# Altium project rp-fly.PrjPcb
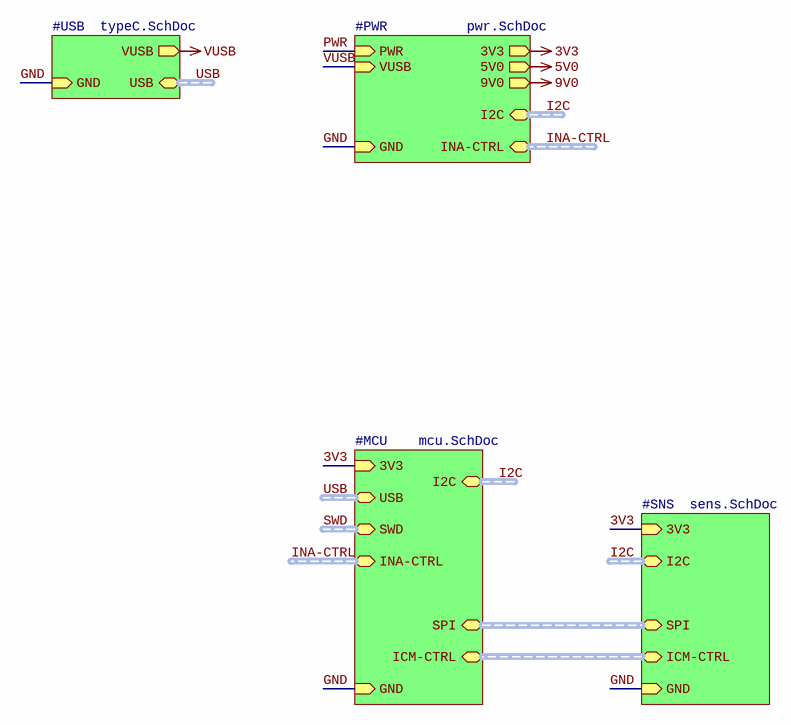
[diagram p0: rp-fly.SchDoc]
9 sheets, 46 parts. Net scope: hierarchical (ports join the sheet entries above them; power ports are global).
Board file: rp-fly.PcbDoc
Sheets:
  rp-fly.SchDoc
    #MCU = mcu.SchDoc
    #USB = typeC.SchDoc
    #PWR = pwr.SchDoc
      #9V0 = 9V0.SchDoc
      #5V0 = 5V0.SchDoc
      #LDO = LDO.SchDoc
      #INA = INA.SchDoc
    #SNS = sens.SchDoc

## Sheet rp-fly.SchDoc
size 209 x 297 mm; DocumentCode: Децимальный номер; SchemeType: Схема электрическая принципиальная; TitleLine1: Название проекта (строка 1); TitleLine2: Название проекта (строка 2); PageSetup: Record=PageOptionsZCenterHorizontal=TrueZCenterVertical=TrueZPrintScale=0.95ZXCorrection=1.00ZYCorrection=1.00ZPrintKind=2ZBorderSize=5000000ZLeftOffset=0ZBottomOffset=0ZOrientation=1ZPaperLength=1000ZPaperWidth=1000ZScale=100ZPaperSource=7ZPrintQuality=600ZMediaType=1ZDitherType=10ZPaperKind=A4 (210 x 297 мм)ZPrintScaleMode=1

### Sub-sheets
#MCU = mcu.SchDoc: 3V3 (in), GND (in), USB (harness USB), SWD (harness SWD), I2C (harness I2C), INA-CTRL (harness INA-CTRL), SPI (harness SPI), ICM-CTRL (harness ICM-CTRL)
#PWR = pwr.SchDoc: PWR (in), VUSB (in), GND (in), 3V3 (out), 5V0 (out), I2C (harness I2C), INA-CTRL (harness INA-CTRL), 9V0 (out)
#SNS = sens.SchDoc: GND (in), 3V3 (in), I2C (harness I2C), SPI (harness SPI), ICM-CTRL (harness ICM-CTRL)
#USB = typeC.SchDoc: USB (harness USB), GND (in), VUSB (out)

### Nets
3V3: sheet #MCU/3V3, sheet #PWR/3V3, sheet #SNS/3V3
GND: sheet #MCU/GND, sheet #USB/GND, sheet #PWR/GND, sheet #SNS/GND
VUSB: sheet #USB/VUSB, sheet #PWR/VUSB

### Buses and harness runs
harness I2C = sheet #MCU/I2C
harness I2C = sheet #PWR/I2C
harness I2C = sheet #SNS/I2C
harness INA-CTRL = sheet #MCU/INA-CTRL
harness INA-CTRL = sheet #PWR/INA-CTRL
harness sheet #MCU/ICM-CTRL = sheet #SNS/ICM-CTRL
harness sheet #MCU/SPI = sheet #SNS/SPI
harness SWD = sheet #MCU/SWD
harness USB = sheet #MCU/USB
harness USB = sheet #USB/USB

### Notes on the sheet
- Перв. примен.
- Справ. №
- Подп. и дата
- Инв. № дубл.
- Взам. инв. №
- Разраб.
- Изм.
- Лист
- № докум.
- Подп.
- Дата
- Лит.
- Масса
- Масштаб
- Пров.
- Т. контр.
- Листов
- Н. контр.
- Утв.
- Нач. лаб.
- Инв. № подл.
- Копировал
- Формат А4

## Sheet mcu.SchDoc
size 209 x 297 mm; DocumentCode: Децимальный номер; SchemeType: Схема электрическая принципиальная; PageSetup: Record=PageOptionsZCenterHorizontal=TrueZCenterVertical=TrueZPrintScale=0.95ZXCorrection=1.00ZYCorrection=1.00ZPrintKind=2ZBorderSize=5000000ZLeftOffset=0ZBottomOffset=0ZOrientation=1ZPaperLength=1000ZPaperWidth=1000ZScale=100ZPaperSource=7ZPrintQuality=600ZMediaType=1ZDitherType=10ZPaperKind=A4 (210 x 297 мм)ZPrintScaleMode=1
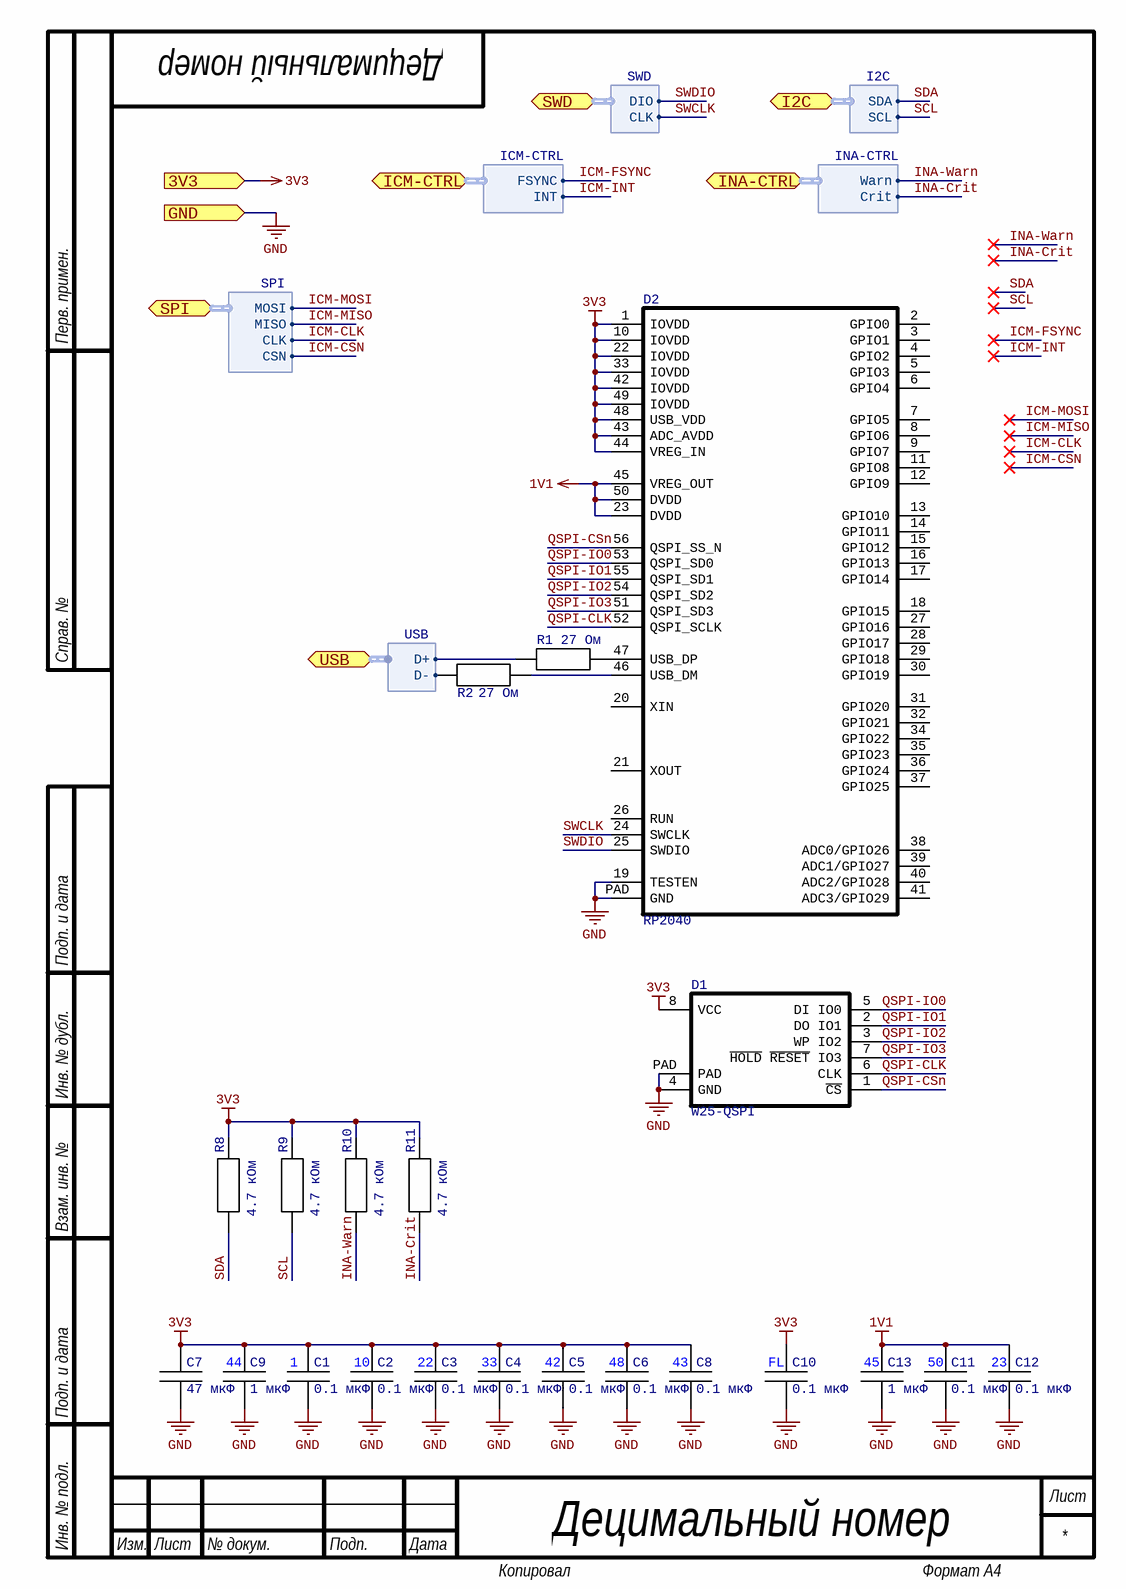
[diagram p1: mcu.SchDoc]

### Parts
C1  value 0.1 мкФ  [STD-0402]  (hidden comment: cap)
C2  value 0.1 мкФ  [STD-0402]  (hidden comment: cap)
C3  value 0.1 мкФ  [STD-0402]  (hidden comment: cap)
C4  value 0.1 мкФ  [STD-0402]  (hidden comment: cap)
C5  value 0.1 мкФ  [STD-0402]  (hidden comment: cap)
C6  value 0.1 мкФ  [STD-0402]  (hidden comment: cap)
C7  value 47 мкФ  [STD-0805]  (hidden comment: cap)
C8  value 0.1 мкФ  [STD-0402]  (hidden comment: cap)
C9  value 1 мкФ  [STD-0402]  (hidden comment: cap)
C10  value 0.1 мкФ  [STD-0402]  (hidden comment: cap)
C11  value 0.1 мкФ  [STD-0402]  (hidden comment: cap)
C12  value 0.1 мкФ  [STD-0402]  (hidden comment: cap)
C13  value 1 мкФ  [STD-0402]  (hidden comment: cap)
D1  W25-QSPI  [WSON-8]
D2  RP2040  [QFN-56]
R1  value 27 Ом  [STD-0402]  (hidden comment: res)
R2  value 27 Ом  [STD-0402]  (hidden comment: res)
R8  value 4.7 кОм  [STD-0402]  (hidden comment: res)
R9  value 4.7 кОм  [STD-0402]  (hidden comment: res)
R10  value 4.7 кОм  [STD-0402]  (hidden comment: res)
R11  value 4.7 кОм  [STD-0402]  (hidden comment: res)

### Ports
3V3 (in), GND (in), I2C (harness I2C), ICM-CTRL (harness ICM-CTRL), INA-CTRL (harness INA-CTRL), SPI (harness SPI), SWD (harness SWD), USB (harness USB)

### Harnesses
USB: D+, D-
I2C: SDA, SCL
INA-CTRL: Warn, Crit
SWD: DIO, CLK
ICM-CTRL: FSYNC, INT
SPI: MOSI, MISO, CLK, CSN

### Nets
1V1: C11.2 C12.2 C13.2 D2.23(DVDD) D2.45(VREG_OUT) D2.50(DVDD)
3V3: C1.2 C2.2 C3.2 C4.2 C5.2 C6.2 C7.2 C8.2 C9.2 C10.2 D1.8(VCC) D2.1(IOVDD) D2.10(IOVDD) D2.22(IOVDD) D2.33(IOVDD) D2.42(IOVDD) D2.43(ADC_AVDD) D2.44(VREG_IN) D2.48(USB_VDD) D2.49(IOVDD) R8.2 R9.2 R10.2 R11.2 ; port 3V3
GND: C1.1 C2.1 C3.1 C4.1 C5.1 C6.1 C7.1 C8.1 C9.1 C10.1 C11.1 C12.1 C13.1 D1.4(GND) D1.PAD D2.19(TESTEN) D2.PAD(GND) ; port GND
INA-Crit: R11.1 ; port INA-CTRL.Crit
INA-Warn: R10.1 ; port INA-CTRL.Warn  [project net INA-CTRL.Warn]
QSPI-CLK: D1.6(CLK) D2.52(QSPI_SCLK)
QSPI-CSn: D1.1(~{CS}) D2.56(QSPI_SS_N)
QSPI-IO0: D1.5(DI_IO0) D2.53(QSPI_SD0)
QSPI-IO1: D1.2(DO_IO1) D2.55(QSPI_SD1)
QSPI-IO2: D1.3(WP_IO2) D2.54(QSPI_SD2)
QSPI-IO3: D1.7(~{HOLD}_~{RESET}_IO3) D2.51(QSPI_SD3)
SCL: R9.1 ; port I2C.SCL  [project net I2C.SCL]
SDA: R8.1 ; port I2C.SDA  [project net I2C.SDA]
SWCLK: D2.24(SWCLK) ; port SWD.CLK
SWDIO: D2.25(SWDIO) ; port SWD.DIO  [project net SWD.DIO]
USB.D+: R1.1 ; port USB.D+
USB.D-: R2.1 ; port USB.D-
NetD2_46: D2.46(USB_DM) R2.2
NetD2_47: D2.47(USB_DP) R1.2

Not connected (* = marked no-connect by the designer): D2 2(GPIO0) 3(GPIO1) 4(GPIO2) 5(GPIO3) 6(GPIO4) 7(GPIO5) 8(GPIO6) 9(GPIO7) 11(GPIO8) 12(GPIO9) 13(GPIO10) 14(GPIO11) 15(GPIO12) 16(GPIO13) 17(GPIO14) 18(GPIO15) 20(XIN) 21(XOUT) 26(RUN) 27(GPIO16) 28(GPIO17) 29(GPIO18) 30(GPIO19) 31(GPIO20) 32(GPIO21) 34(GPIO22) 35(GPIO23) 36(GPIO24) 37(GPIO25) 38(ADC0/GPIO26) 39(ADC1/GPIO27) 40(ADC2/GPIO28) 41(ADC3/GPIO29)

### Notes on the sheet
- (near C9) 44
- (near C1) 1
- (near C2) 10
- (near C3) 22
- (near C4) 33
- (near C5) 42
- (near C6) 48
- (near C8) 43
- (near C10) FL
- (near C13) 45
- (near C11) 50
- (near C12) 23
- Перв. примен.
- Справ. №
- Подп. и дата
- Инв. № дубл.
- Взам. инв. №
- Изм.
- Лист
- № докум.
- Подп.
- Дата
- Инв. № подл.
- Копировал
- Формат А4

### Library data of the parts
C1-C6 C8 C10-C12 = C0402-0u1-50v-10%-X7R: Конденсатор; Part Number: C0402-0u1-50v-10%-X7R
C7 = C0805-47u-6.3v-20%-X5R: Конденсатор; Part Number: C0805-47u-6.3v-20%-X5R
C9 C13 = C0402-1u-16v-10%-X7R: Конденсатор; Part Number: C0402-1u-16v-10%-X7R
D1 = W25Q128JVPIQ: Flash память 16 МБайт; Part Number: W25Q128JVPIQ
D2 = RP2040: Микроконтроллер; Part Number: RP2040
R1 R2 = R0402-27r-1%-1/16W: Резистор; Part Number: R0402-27r-1%-1/16W
R8-R11 = R0402-4k7-1%-1/16W: Резистор; Part Number: R0402-4k7-1%-1/16W

## Sheet typeC.SchDoc
size 209 x 297 mm; DocumentCode: Децимальный номер; SchemeType: Схема электрическая принципиальная; PageSetup: Record=PageOptionsZCenterHorizontal=TrueZCenterVertical=TrueZPrintScale=0.95ZXCorrection=1.00ZYCorrection=1.00ZPrintKind=2ZBorderSize=5000000ZLeftOffset=0ZBottomOffset=0ZOrientation=1ZPaperLength=1000ZPaperWidth=1000ZScale=100ZPaperSource=7ZPrintQuality=600ZMediaType=1ZDitherType=10ZPaperKind=A4 (210 x 297 мм)ZPrintScaleMode=1
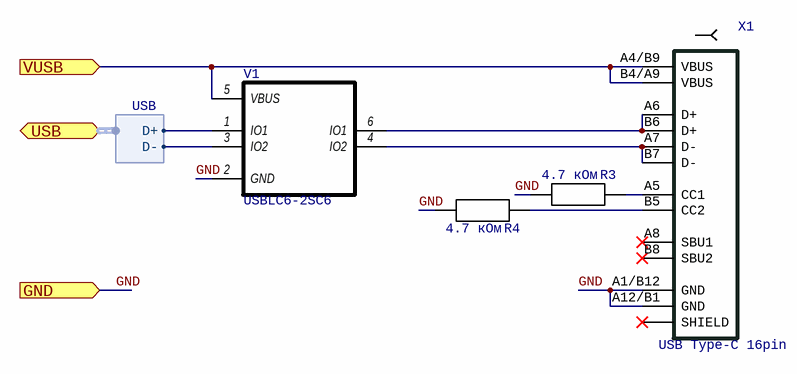
[diagram p2: typeC.SchDoc]

### Parts
R3  value 4.7 кОм  [STD-0402]  (hidden comment: res)
R4  value 4.7 кОм  [STD-0402]  (hidden comment: res)
V1  USBLC6-2SC6  [SOT-23-6]
X1  USB Type-C 16pin  [USB Type-C]

### Ports
GND (in), USB (harness USB), VUSB (in)

### Harnesses
USB: D+, D-

### Nets
GND: R3.2 R4.2 V1.2(GND) X1.A1/B12(GND) X1.A12/B1(GND) ; port GND
VUSB: V1.5(VBUS) X1.A4/B9(VBUS) X1.B4/A9(VBUS) ; port VUSB
USB.D+: V1.1(IO1) ; port USB.D+
USB.D-: V1.3(IO2) ; port USB.D-
NetR3_1: R3.1 X1.A5(CC1)
NetR4_1: R4.1 X1.B5(CC2)
NetV1_4: V1.4(IO2) X1.A7(D-) X1.B7(D-)
NetV1_6: V1.6(IO1) X1.A6(D+) X1.B6(D+)

Not connected (* = marked no-connect by the designer): X1 A8(SBU1)* B8(SBU2)* SHIELD*

### Notes on the sheet
- Перв. примен.
- Справ. №
- Подп. и дата
- Инв. № дубл.
- Взам. инв. №
- Изм.
- Лист
- № докум.
- Подп.
- Дата
- Инв. № подл.
- Копировал
- Формат А4

### Library data of the parts
R3 R4 = R0402-4k7-1%-1/16W: Резистор; Part Number: R0402-4k7-1%-1/16W
V1 = CMP-0703-A.2: ESD защита, 3.5 пФ, 150 нА, USB; Manufacturer: ST Microelectronics; Temperature: -40 - 150°C
X1 = USB Type-C 16 pin ALI: USB Type-C; Part Number: USB Type-C 16 pin ALI

## Sheet pwr.SchDoc
size 209 x 297 mm; DocumentCode: Децимальный номер; SchemeType: Схема электрическая принципиальная; PageSetup: Record=PageOptionsZCenterHorizontal=TrueZCenterVertical=TrueZPrintScale=0.95ZXCorrection=1.00ZYCorrection=1.00ZPrintKind=2ZBorderSize=5000000ZLeftOffset=0ZBottomOffset=0ZOrientation=1ZPaperLength=1000ZPaperWidth=1000ZScale=100ZPaperSource=7ZPrintQuality=600ZMediaType=1ZDitherType=10ZPaperKind=A4 (210 x 297 мм)ZPrintScaleMode=1
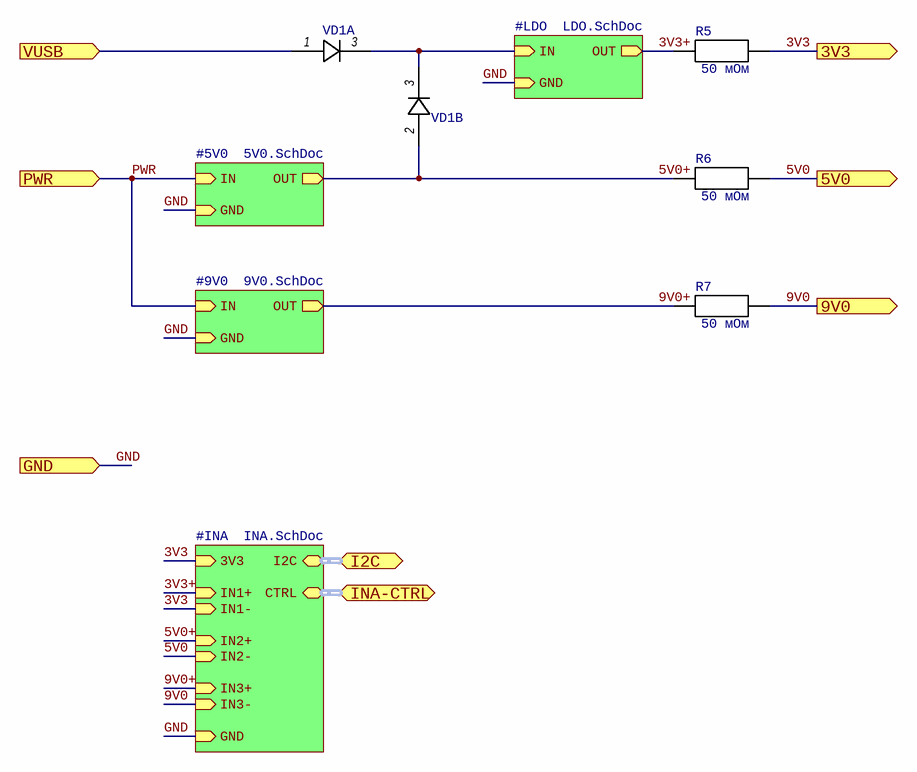
[diagram p3: pwr.SchDoc]

### Parts
R5  value 50 мОм  [STD-0805]  (hidden comment: res)
R6  value 50 мОм  [STD-0805]  (hidden comment: res)
R7  value 50 мОм  [STD-0805]  (hidden comment: res)
VD1  diode-2k  [SOT-23-3]  (value not drawn)  (parts A,B of 2)

### Sub-sheets
#5V0 = 5V0.SchDoc: GND (in), IN (in), OUT (out)
#9V0 = 9V0.SchDoc: GND (in), IN (in), OUT (out)
#INA = INA.SchDoc: GND (in), 3V3 (in), IN1+ (in), IN1- (in), IN2+ (in), IN2- (in), IN3+ (in), IN3- (in), I2C (harness I2C), CTRL (harness INA-CTRL)
#LDO = LDO.SchDoc: GND (in), IN (in), OUT (out)

### Ports
3V3 (out), 5V0 (out), 9V0 (out), GND (in), I2C (harness I2C), INA-CTRL (harness I2C), PWR (in), VUSB (in)

### Nets
3V3: R5.2 ; port 3V3, sheet #INA/3V3, sheet #INA/IN1-
5V0: R6.2 ; port 5V0, sheet #INA/IN2-
9V0: R7.2 ; port 9V0, sheet #INA/IN3-
GND: port GND, sheet #9V0/GND, sheet #5V0/GND, sheet #LDO/GND, sheet #INA/GND
VUSB: VD1.1 ; port VUSB
3V3+: R5.1 ; sheet #LDO/OUT, sheet #INA/IN1+
5V0+: R6.1 VD1.2 ; sheet #5V0/OUT, sheet #INA/IN2+
9V0+: R7.1 ; sheet #9V0/OUT, sheet #INA/IN3+
PWR: port PWR, sheet #9V0/IN, sheet #5V0/IN
NetC14_2: VD1.3 ; sheet #LDO/IN

### Buses and harness runs
harness port I2C = sheet #INA/I2C
harness port INA-CTRL = sheet #INA/CTRL

### Notes on the sheet
- Перв. примен.
- Справ. №
- Подп. и дата
- Инв. № дубл.
- Взам. инв. №
- Изм.
- Лист
- № докум.
- Подп.
- Дата
- Инв. № подл.
- Копировал
- Формат А4

### Library data of the parts
R5-R7 = R0805-r05-1%-1/4W: Резистор; Part Number: R0805-r05-1%-1/4W
VD1 = PMEG2005CT.215: Диод сдвоенный; Part Number: PMEG2005CT.215

## Sheet 9V0.SchDoc
size 209 x 297 mm; DocumentCode: Децимальный номер; SchemeType: Схема электрическая принципиальная; PageSetup: Record=PageOptionsZCenterHorizontal=TrueZCenterVertical=TrueZPrintScale=0.95ZXCorrection=1.00ZYCorrection=1.00ZPrintKind=2ZBorderSize=5000000ZLeftOffset=0ZBottomOffset=0ZOrientation=1ZPaperLength=1000ZPaperWidth=1000ZScale=100ZPaperSource=7ZPrintQuality=600ZMediaType=1ZDitherType=10ZPaperKind=A4 (210 x 297 мм)ZPrintScaleMode=1

### Notes on the sheet
- Перв. примен.
- Справ. №
- Подп. и дата
- Инв. № дубл.
- Взам. инв. №
- Изм.
- Лист
- № докум.
- Подп.
- Дата
- Инв. № подл.
- Копировал
- Формат А4

## Sheet 5V0.SchDoc
size 209 x 297 mm; DocumentCode: Децимальный номер; SchemeType: Схема электрическая принципиальная; PageSetup: Record=PageOptionsZCenterHorizontal=TrueZCenterVertical=TrueZPrintScale=0.95ZXCorrection=1.00ZYCorrection=1.00ZPrintKind=2ZBorderSize=5000000ZLeftOffset=0ZBottomOffset=0ZOrientation=1ZPaperLength=1000ZPaperWidth=1000ZScale=100ZPaperSource=7ZPrintQuality=600ZMediaType=1ZDitherType=10ZPaperKind=A4 (210 x 297 мм)ZPrintScaleMode=1
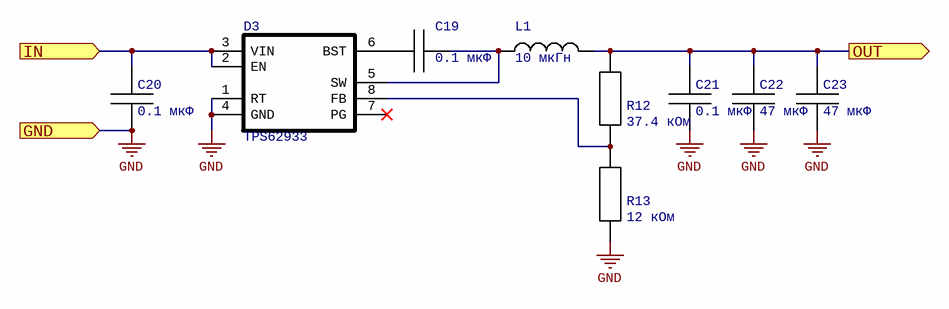
[diagram p4: 5V0.SchDoc]

### Parts
C19  value 0.1 мкФ  [STD-0402]  (hidden comment: cap)
C20  value 0.1 мкФ  [STD-0402]  (hidden comment: cap)
C21  value 0.1 мкФ  [STD-0402]  (hidden comment: cap)
C22  value 47 мкФ  [STD-0805]  (hidden comment: cap)
C23  value 47 мкФ  [STD-0805]  (hidden comment: cap)
D3  TPS62933  [SOT-583]
L1  value 10 мкГн  [IND-0630]  (hidden comment: ind)
R12  value 37.4 кОм  [STD-0402]  (hidden comment: res)
R13  value 12 кОм  [STD-0402]  (hidden comment: res)

### Ports
GND (in), IN (in), OUT (out)

### Nets
GND: C20.1 C21.1 C22.1 C23.1 D3.1(RT) D3.4(GND) R13.1 ; port GND
5V0+: C21.2 C22.2 C23.2 L1.2 R12.2 ; port OUT
PWR: C20.2 D3.2(EN) D3.3(VIN) ; port IN
NetC19_1: C19.1 D3.5(SW) L1.1
NetC19_2: C19.2 D3.6(BST)
NetD3_8: D3.8(FB) R12.1 R13.2

Not connected (* = marked no-connect by the designer): D3 7(PG)*

### Notes on the sheet
- Перв. примен.
- Справ. №
- Подп. и дата
- Инв. № дубл.
- Взам. инв. №
- Изм.
- Лист
- № докум.
- Подп.
- Дата
- Инв. № подл.
- Копировал
- Формат А4

### Library data of the parts
C19-C21 = C0402-0u1-50v-10%-X7R: Конденсатор; Part Number: C0402-0u1-50v-10%-X7R
C22 C23 = C0805-47u-6.3v-20%-X5R: Конденсатор; Part Number: C0805-47u-6.3v-20%-X5R
D3 = TPS62933PDRLR: DC-DC; Part Number: TPS62933PDRLR
L1 = CKST0603-10: Индуктивность; Part Number: CKST0603-10
R12 = R0402-37k4-1%-1/16W: Резистор; Part Number: R0402-37k4-1%-1/16W
R13 = R0402-12k-1%-1/16W: Резистор; Part Number: R0402-12k-1%-1/16W

## Sheet LDO.SchDoc
size 209 x 297 mm; DocumentCode: Децимальный номер; SchemeType: Схема электрическая принципиальная; PageSetup: Record=PageOptionsZCenterHorizontal=TrueZCenterVertical=TrueZPrintScale=0.95ZXCorrection=1.00ZYCorrection=1.00ZPrintKind=2ZBorderSize=5000000ZLeftOffset=0ZBottomOffset=0ZOrientation=1ZPaperLength=1000ZPaperWidth=1000ZScale=100ZPaperSource=7ZPrintQuality=600ZMediaType=1ZDitherType=10ZPaperKind=A4 (210 x 297 мм)ZPrintScaleMode=1
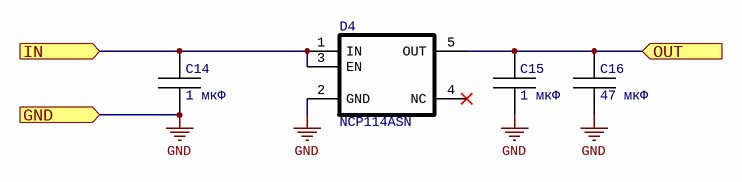
[diagram p5: LDO.SchDoc]

### Parts
C14  value 1 мкФ  [STD-0402]  (hidden comment: cap)
C15  value 1 мкФ  [STD-0402]  (hidden comment: cap)
C16  value 47 мкФ  [STD-0805]  (hidden comment: cap)
D4  NCP114ASN  [SOT-23-5]

### Ports
GND (in), IN (in), OUT (in)

### Nets
GND: C14.1 C15.1 C16.1 D4.2(GND) ; port GND
3V3+: C15.2 C16.2 D4.5(OUT) ; port OUT
NetC14_2: C14.2 D4.1(IN) D4.3(EN) ; port IN

Not connected (* = marked no-connect by the designer): D4 4(NC)*

### Notes on the sheet
- Перв. примен.
- Справ. №
- Подп. и дата
- Инв. № дубл.
- Взам. инв. №
- Изм.
- Лист
- № докум.
- Подп.
- Дата
- Инв. № подл.
- Копировал
- Формат А4

### Library data of the parts
C14 C15 = C0402-1u-16v-10%-X7R: Конденсатор; Part Number: C0402-1u-16v-10%-X7R
C16 = C0805-47u-6.3v-20%-X5R: Конденсатор; Part Number: C0805-47u-6.3v-20%-X5R
D4 = NCP114ASN330T1G: LDO; Part Number: NCP114ASN330T1G

## Sheet INA.SchDoc
size 209 x 297 mm; DocumentCode: Децимальный номер; SchemeType: Схема электрическая принципиальная; PageSetup: Record=PageOptionsZCenterHorizontal=TrueZCenterVertical=TrueZPrintScale=0.95ZXCorrection=1.00ZYCorrection=1.00ZPrintKind=2ZBorderSize=5000000ZLeftOffset=0ZBottomOffset=0ZOrientation=1ZPaperLength=1000ZPaperWidth=1000ZScale=100ZPaperSource=7ZPrintQuality=600ZMediaType=1ZDitherType=10ZPaperKind=A4 (210 x 297 мм)ZPrintScaleMode=1
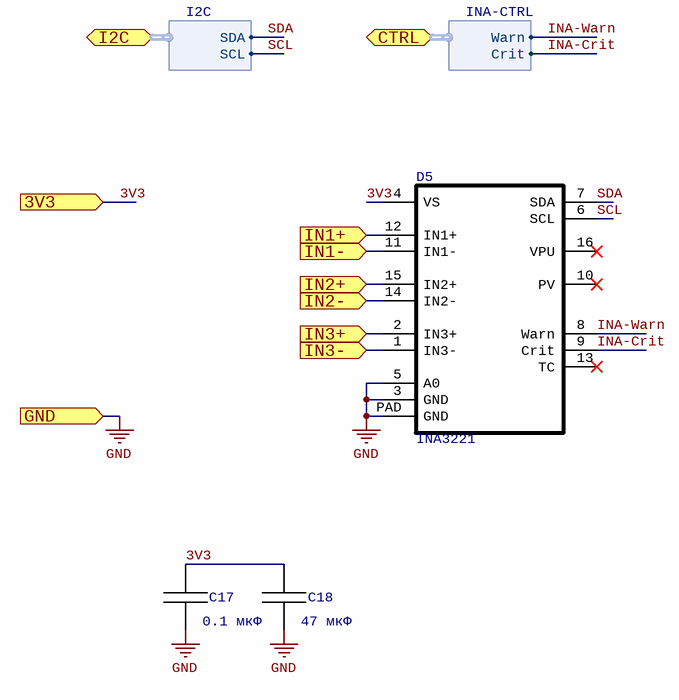
[diagram p6: INA.SchDoc]

### Parts
C17  value 0.1 мкФ  [STD-0402]  (hidden comment: cap)
C18  value 47 мкФ  [STD-0805]  (hidden comment: cap)
D5  INA3221  [VQFN-16]

### Ports
3V3 (in), CTRL (harness INA-CTRL), GND (in), I2C (harness I2C), IN1+ (in), IN1- (in), IN2+ (in), IN2- (in), IN3+ (in), IN3- (in)

### Harnesses
I2C: SDA, SCL
INA-CTRL: Warn, Crit

### Nets
3V3: C17.2 C18.2 D5.4(VS) D5.11(IN1-) ; port IN1-, port 3V3
5V0: D5.14(IN2-) ; port IN2-
9V0: D5.1(IN3-) ; port IN3-
GND: C17.1 C18.1 D5.3(GND) D5.5(A0) D5.PAD(GND) ; port GND
3V3+: D5.12(IN1+) ; port IN1+
5V0+: D5.15(IN2+) ; port IN2+
9V0+: D5.2(IN3+) ; port IN3+
INA-Crit: D5.9(Crit) ; port CTRL.Crit
INA-Warn: D5.8(Warn) ; port CTRL.Warn  [project net INA-CTRL.Warn]
SCL: D5.6(SCL) ; port I2C.SCL  [project net I2C.SCL]
SDA: D5.7(SDA) ; port I2C.SDA  [project net I2C.SDA]

Not connected (* = marked no-connect by the designer): D5 10(PV)* 13(TC)* 16(VPU)*

### Notes on the sheet
- Перв. примен.
- Справ. №
- Подп. и дата
- Инв. № дубл.
- Взам. инв. №
- Изм.
- Лист
- № докум.
- Подп.
- Дата
- Инв. № подл.
- Копировал
- Формат А4

### Library data of the parts
C17 = C0402-0u1-50v-10%-X7R: Конденсатор; Part Number: C0402-0u1-50v-10%-X7R
C18 = C0805-47u-6.3v-20%-X5R: Конденсатор; Part Number: C0805-47u-6.3v-20%-X5R
D5 = INA3221AIRGVT: Монитор питания; Part Number: INA3221AIRGVT

## Sheet sens.SchDoc
size 209 x 297 mm; DocumentCode: Децимальный номер; SchemeType: Схема электрическая принципиальная; PageSetup: Record=PageOptionsZCenterHorizontal=TrueZCenterVertical=TrueZPrintScale=0.95ZXCorrection=1.00ZYCorrection=1.00ZPrintKind=2ZBorderSize=5000000ZLeftOffset=0ZBottomOffset=0ZOrientation=1ZPaperLength=1000ZPaperWidth=1000ZScale=100ZPaperSource=7ZPrintQuality=600ZMediaType=1ZDitherType=10ZPaperKind=A4 (210 x 297 мм)ZPrintScaleMode=1
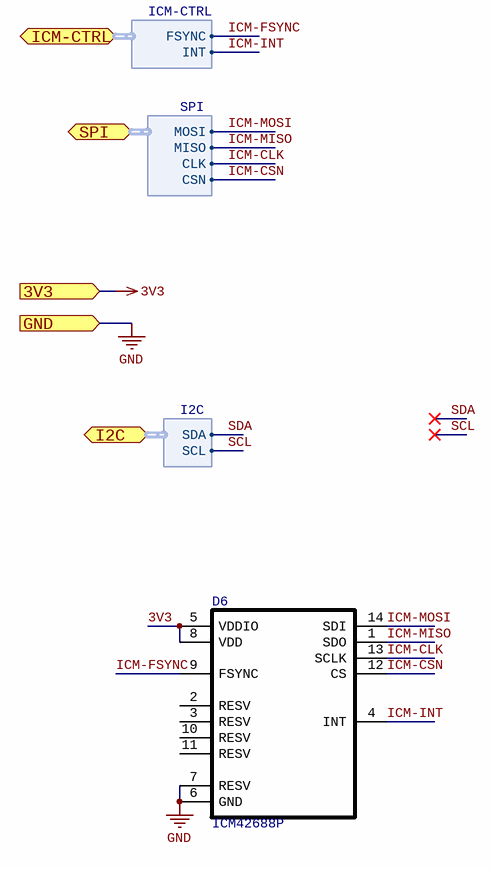
[diagram p7: sens.SchDoc]

### Parts
D6  ICM42688P  [LGA-14]

### Ports
3V3 (in), GND (in), I2C (harness I2C), ICM-CTRL (harness ICM-CTRL), SPI (harness SPI)

### Harnesses
ICM-CTRL: FSYNC, INT
SPI: MOSI, MISO, CLK, CSN
I2C: SDA, SCL

### Nets
3V3: D6.5(VDDIO) D6.8(VDD) ; port 3V3
GND: D6.6(GND) D6.7(RESV) ; port GND
ICM-CLK: D6.13(SCLK) ; port SPI.CLK
ICM-CSN: D6.12(CS) ; port SPI.CSN
ICM-FSYNC: D6.9(FSYNC) ; port ICM-CTRL.FSYNC
ICM-INT: D6.4(INT) ; port ICM-CTRL.INT
ICM-MISO: D6.1(SDO) ; port SPI.MISO
ICM-MOSI: D6.14(SDI) ; port SPI.MOSI

Not connected (* = marked no-connect by the designer): D6 2(RESV) 3(RESV) 10(RESV) 11(RESV)

### Notes on the sheet
- Перв. примен.
- Справ. №
- Подп. и дата
- Инв. № дубл.
- Взам. инв. №
- Изм.
- Лист
- № докум.
- Подп.
- Дата
- Инв. № подл.
- Копировал
- Формат А4

### Library data of the parts
D6 = ICM42688P: Гироскоп, акселерометр; Part Number: ICM42688P

## Nets that join several sheets
3V3: mcu (24 pins), pwr (R5.2), INA (C17.2 C18.2 D5.4 D5.11), sens (D6.5 D6.8)
5V0: pwr (R6.2), INA (D5.14)
9V0: pwr (R7.2), INA (D5.1)
GND: mcu (17 pins), typeC (5 pins), 5V0 (7 pins), LDO (C14.1 C15.1 C16.1 D4.2), INA (5 pins), sens (D6.6 D6.7)
VUSB: typeC (V1.5 X1.A4/B9 X1.B4/A9), pwr (VD1.1)
3V3+: pwr (R5.1), LDO (C15.2 C16.2 D4.5), INA (D5.12)
5V0+: pwr (R6.1 VD1.2), 5V0 (5 pins), INA (D5.15)
9V0+: pwr (R7.1), INA (D5.2)
I2C.SCL: mcu (R9.1), INA (D5.6)
I2C.SDA: mcu (R8.1), INA (D5.7)
INA-Crit: mcu (R11.1), INA (D5.9)
INA-CTRL.Warn: mcu (R10.1), INA (D5.8)
NetC14_2: pwr (VD1.3), LDO (C14.2 D4.1 D4.3)
USB.D+: mcu (R1.1), typeC (V1.1)
USB.D-: mcu (R2.1), typeC (V1.3)